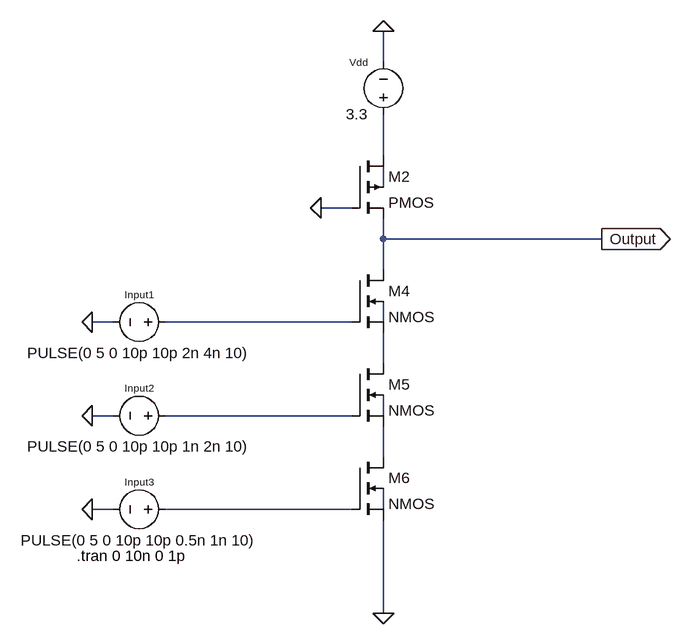
[diagram p0: schematic 3 Input NAND Pseudo-NMOS.asc]
3 Input NAND Pseudo-NMOS.asc, the LTspice schematic file:
Version 4
SHEET 1 880 776
WIRE 288 -192 288 -240
WIRE 288 -48 288 -112
WIRE 288 0 288 -32
WIRE 240 32 192 32
WIRE 288 80 288 48
WIRE 624 80 288 80
WIRE 288 128 288 80
WIRE -128 208 -160 208
WIRE 240 208 -48 208
WIRE 288 208 288 176
WIRE 288 272 288 224
WIRE -128 352 -160 352
WIRE 240 352 -48 352
WIRE 288 352 288 320
WIRE 288 416 288 368
WIRE -128 496 -160 496
WIRE 240 496 -48 496
WIRE 288 496 288 464
WIRE 288 656 288 512
FLAG 288 -240 0
FLAG -160 208 0
FLAG -160 352 0
FLAG -160 496 0
FLAG 624 80 Output
IOPIN 624 80 Out
FLAG 288 656 0
FLAG 192 32 0
SYMBOL pmos4 240 -48 R0
SYMATTR InstName M2
SYMATTR Value2 l=0.18u w=0.18u
SYMBOL voltage 288 -96 R180
WINDOW 0 24 96 Left 1
WINDOW 3 24 16 Left 2
WINDOW 123 0 0 Left 0
WINDOW 39 0 0 Left 0
SYMATTR InstName Vdd
SYMATTR Value 3.3
SYMBOL nmos4 240 128 R0
SYMATTR InstName M4
SYMATTR Value2 l=0.18u w=0.9u
SYMBOL nmos4 240 272 R0
SYMATTR InstName M5
SYMATTR Value2 l=0.18u w=0.9u
SYMBOL nmos4 240 416 R0
SYMATTR InstName M6
SYMATTR Value2 l=0.18u w=0.9u
SYMBOL voltage -32 208 R90
WINDOW 0 -32 56 VBottom 1
WINDOW 3 32 56 VTop 2
WINDOW 123 0 0 Left 0
WINDOW 39 0 0 Left 0
SYMATTR InstName Input1
SYMATTR Value PULSE(0 5 0 10p 10p 2n 4n 10)
SYMBOL voltage -32 352 R90
WINDOW 0 -32 56 VBottom 1
WINDOW 3 32 56 VTop 2
WINDOW 123 0 0 Left 0
WINDOW 39 0 0 Left 0
SYMATTR InstName Input2
SYMATTR Value PULSE(0 5 0 10p 10p 1n 2n 10)
SYMBOL voltage -32 496 R90
WINDOW 0 -32 56 VBottom 1
WINDOW 3 32 56 VTop 2
WINDOW 123 0 0 Left 0
WINDOW 39 0 0 Left 0
SYMATTR InstName Input3
SYMATTR Value PULSE(0 5 0 10p 10p 0.5n 1n 10)
TEXT -184 568 Left 2 !.tran 0 10n 0 1p

The netlist it stands for:
* 3 Input NAND Pseudo-NMOS.asc
M2 N001 0 Output N002 PMOS l=0.18u w=0.18u
Vdd N001 0 3.3
M4 Output N003 N005 N004 NMOS l=0.18u w=0.9u
M5 N005 N006 N008 N007 NMOS l=0.18u w=0.9u
M6 N008 N009 0 N010 NMOS l=0.18u w=0.9u
V§Input1 N003 0 PULSE(0 5 0 10p 10p 2n 4n 10)
V§Input2 N006 0 PULSE(0 5 0 10p 10p 1n 2n 10)
V§Input3 N009 0 PULSE(0 5 0 10p 10p 0.5n 1n 10)
.model NMOS NMOS
.model PMOS PMOS
.lib standard.mos
.tran 0 10n 0 1p
.backanno
.end